# EAGLE schematic MIXER (EAGLE 9.2.2)

## Sheet 1 of 6: Main Board Top Level
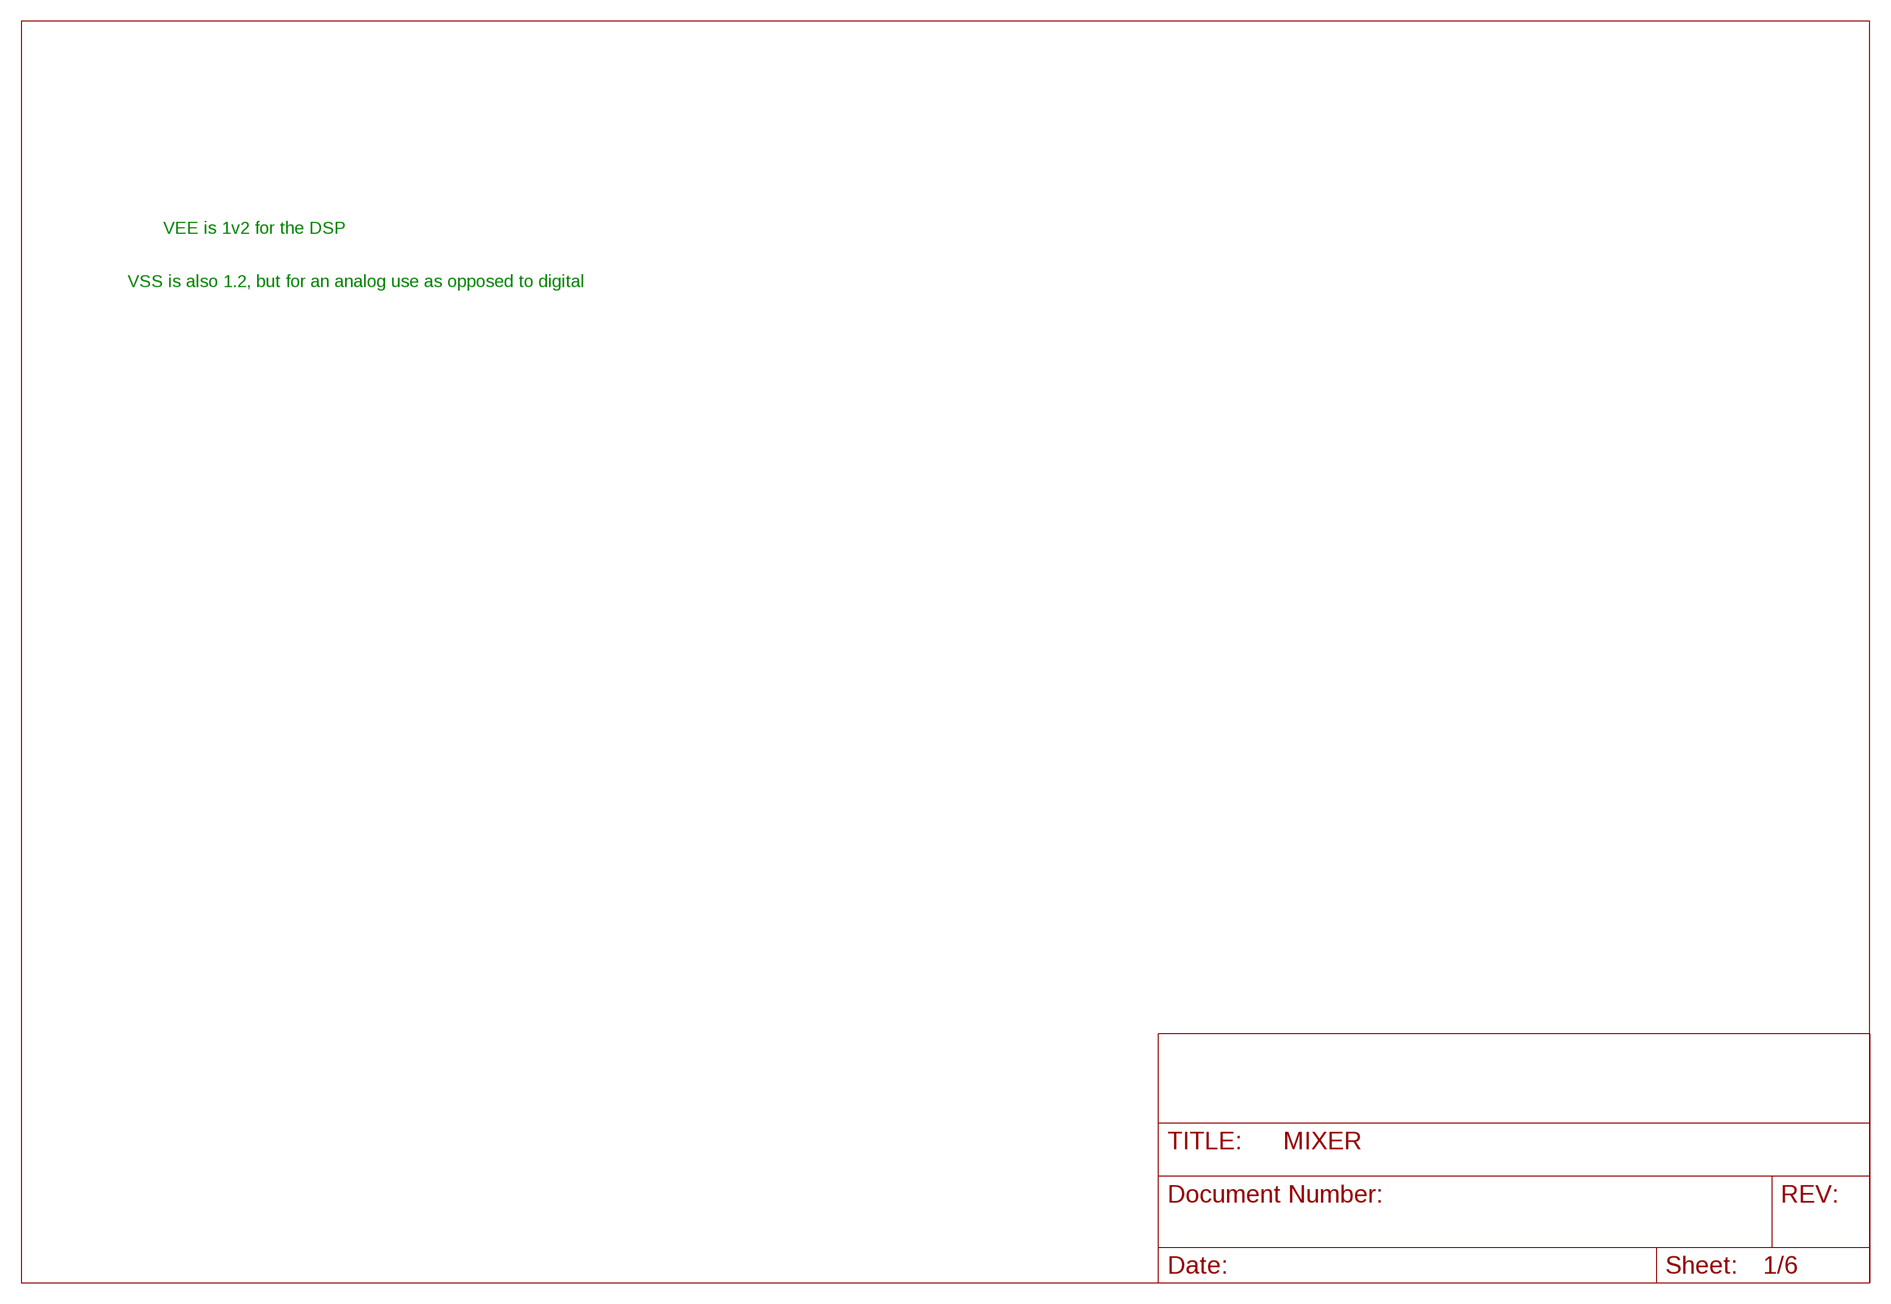
[diagram p0: schematic, sheet 1]

### Notes on the sheet
- VEE is 1v2 for the DSP
- VSS is also 1.2, but for an analog use as opposed to digital

## Sheet 2 of 6: Power Supply
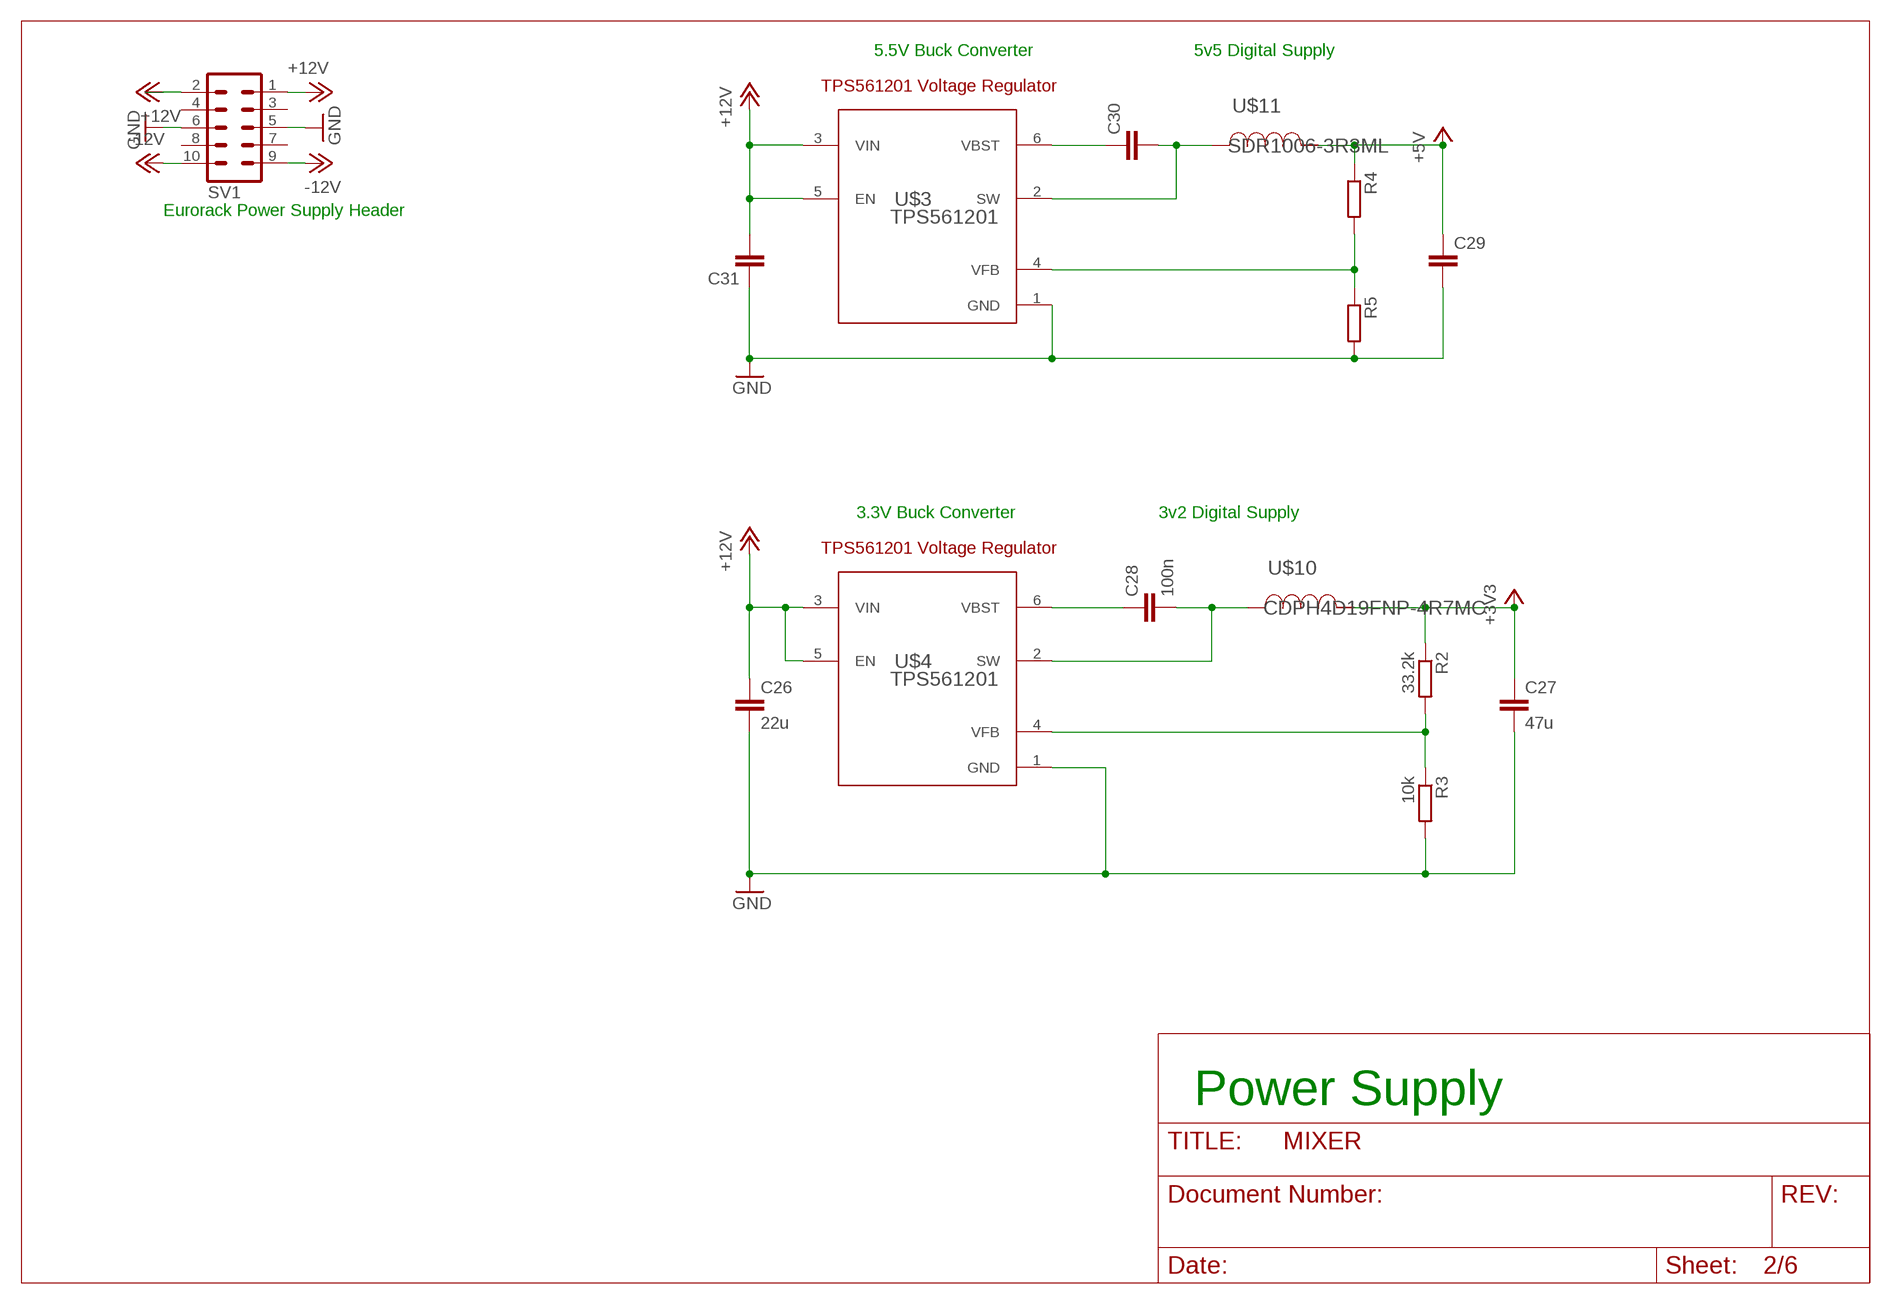
[diagram p1: schematic, sheet 2]

### Parts
C26  22u  C-EUC0805  [C0805]
C27  47u  C-EUC0805  [C0805]
C28  100n  C-EUC0805  [C0805]
C29  C-EUC0805  [C0805]
C30  C-EUC0805  [C0805]
C31  C-EUC0805  [C0805]
R2  33.2k  R-EU_R0805  [R0805]
R3  10k  R-EU_R0805  [R0805]
R4  R-EU_R0805  [R0805]
R5  R-EU_R0805  [R0805]
SV1  MA05-2  [MA05-2]
U$3  TPS561201  [DDC0006A]
U$4  TPS561201  [DDC0006A]
U$10  CDPH4D19FNP-4R7MC  [CDPH4D19F]
U$11  SDR1006-3R3ML  [SDR1006]

### Nets
+3V3: C27.1 R2.1 U$10.2 ; also sheet 3,4
+5V: C29.1 R4.1 U$11.2
+12V: C26.1 C31.2 SV1.1 SV1.2 U$3.3(VIN) U$3.5(EN) U$4.3(VIN) U$4.5(EN)
-12V: SV1.9 SV1.10
GND: C26.2 C27.2 C29.2 C31.1 R3.2 R5.2 SV1.5 SV1.6 U$3.1(GND) U$4.1(GND) ; also sheet 3,4
N$2: C30.1 U$3.6(VBST)
N$3: C28.1 U$4.6(VBST)
N$4: C28.2 U$4.2(SW) U$10.1
N$5: C30.2 U$3.2(SW) U$11.1
N$6: R2.2 R3.1 U$4.4(VFB)
N$8: R4.2 R5.1 U$3.4(VFB)
Unconnected: SV1.3 SV1.4 SV1.7 SV1.8

### Notes on the sheet
- 5.5V Buck Converter | 5v5 Digital Supply
- Eurorack Power Supply Header
- 3.3V Buck Converter | 3v2 Digital Supply
- Power Supply

## Sheet 3 of 6: Supply Decoupling
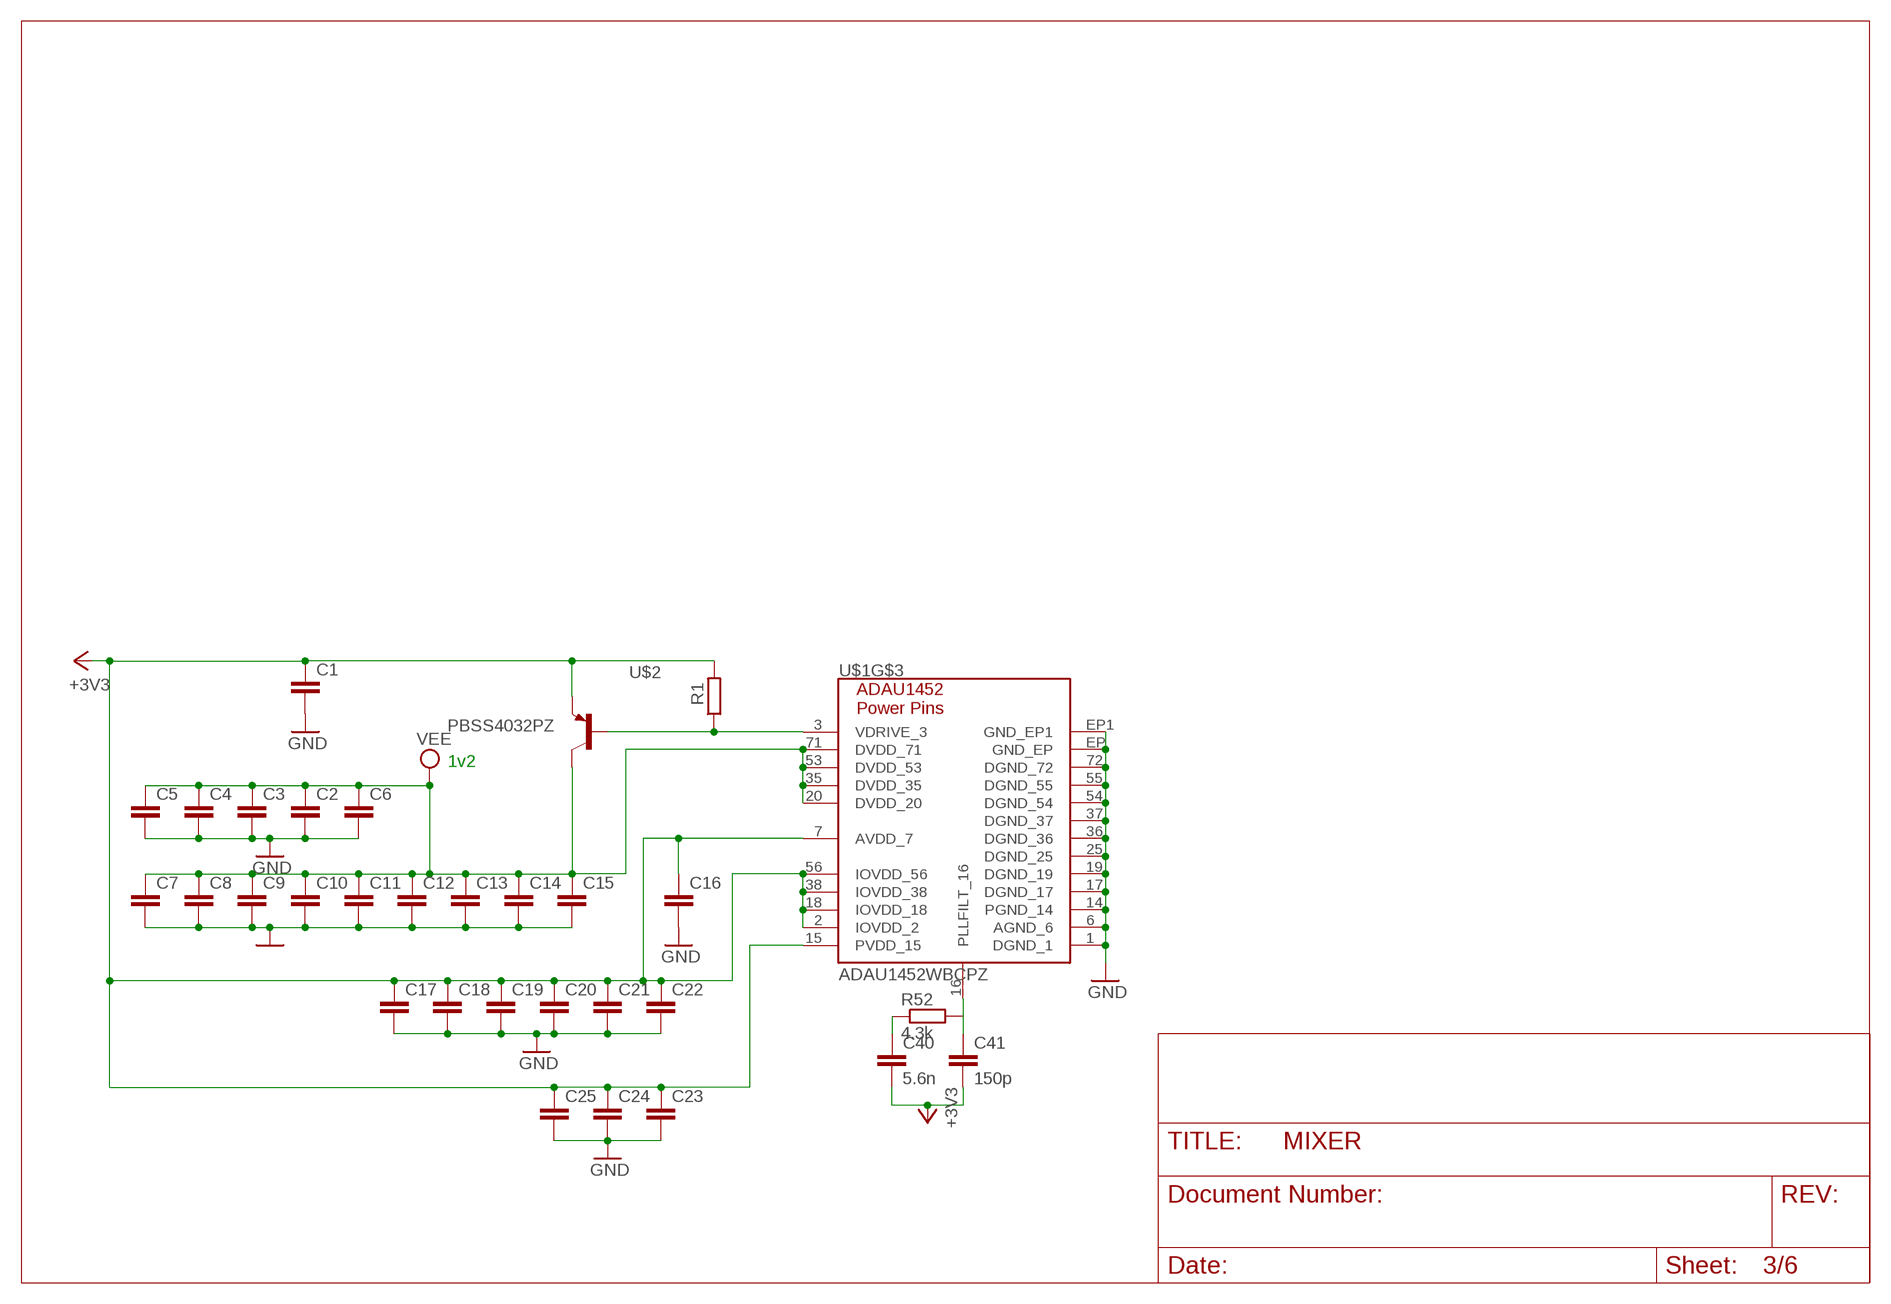
[diagram p2: schematic, sheet 3]

### Parts
C1  C-EUC0603  [C0603]
C2  C-EUC0603  [C0603]
C3  C-EUC0603  [C0603]
C4  C-EUC0603  [C0603]
C5  C-EUC0603  [C0603]
C6  C-EUC0603  [C0603]
C7  C-EUC0603  [C0603]
C8  C-EUC0603  [C0603]
C9  C-EUC0603  [C0603]
C10  C-EUC0603  [C0603]
C11  C-EUC0603  [C0603]
C12  C-EUC0603  [C0603]
C13  C-EUC0603  [C0603]
C14  C-EUC0603  [C0603]
C15  C-EUC0603  [C0603]
C16  C-EUC0603  [C0603]
C17  C-EUC0603  [C0603]
C18  C-EUC0603  [C0603]
C19  C-EUC0603  [C0603]
C20  C-EUC0603  [C0603]
C21  C-EUC0603  [C0603]
C22  C-EUC0603  [C0603]
C23  C-EUC0603  [C0603]
C24  C-EUC0603  [C0603]
C25  C-EUC0603  [C0603]
C40  5.6n  C-EUC0805  [C0805]
C41  150p  C-EUC0805  [C0805]
R1  R-EU_R0603  [R0603]
R52  4.3k  R-EU_R0603  [R0603]
U$1  ADAU1452WBCPZ  [72-LEADLFCSP_VQ]
U$2  PBSS4032PZ  [PG-SOT-223]

### Nets
+3V3: C1.1 C16.1 C17.1 C18.1 C19.1 C20.1 C21.1 C22.1 C23.1 C24.1 C25.1 C40.2 C41.2 R1.2 U$1.2(IOVDD_2) U$1.7(AVDD_7) U$1.15(PVDD_15) U$1.18(IOVDD_18) U$1.38(IOVDD_38) U$1.56(IOVDD_56) U$2.3(EMITTER_3) ; also sheet 2,4
GND: C1.2 C2.2 C3.2 C4.2 C5.2 C6.2 C7.2 C8.2 C9.2 C10.2 C11.2 C12.2 C13.2 C14.2 C15.2 C16.2 C17.2 C18.2 C19.2 C20.2 C21.2 C22.2 C23.2 C24.2 C25.2 U$1.1(DGND_1) U$1.6(AGND_6) U$1.14(PGND_14) U$1.17(DGND_17) U$1.19(DGND_19) U$1.25(DGND_25) U$1.36(DGND_36) U$1.37(DGND_37) U$1.54(DGND_54) U$1.55(DGND_55) U$1.72(DGND_72) U$1.EP1(GND_EP1) U$1.EP(GND_EP) ; also sheet 2,4
N$1: R1.1 U$1.3(VDRIVE_3) U$2.1(BASE_1)
N$21: C41.1 U$1.16(PLLFILT_16)
N$24: C40.1 R52.1
VEE: C2.1 C3.1 C4.1 C5.1 C6.1 C7.1 C8.1 C9.1 C10.1 C11.1 C12.1 C13.1 C14.1 C15.1 U$1.20(DVDD_20) U$1.35(DVDD_35) U$1.53(DVDD_53) U$1.71(DVDD_71) U$2.2(COLLECTOR_2,4) U$2.4(COLLECTOR_2,4)
Unconnected: R52.2

### Notes on the sheet
- 1v2

## Sheet 4 of 6: Controller, I2C & GPIO
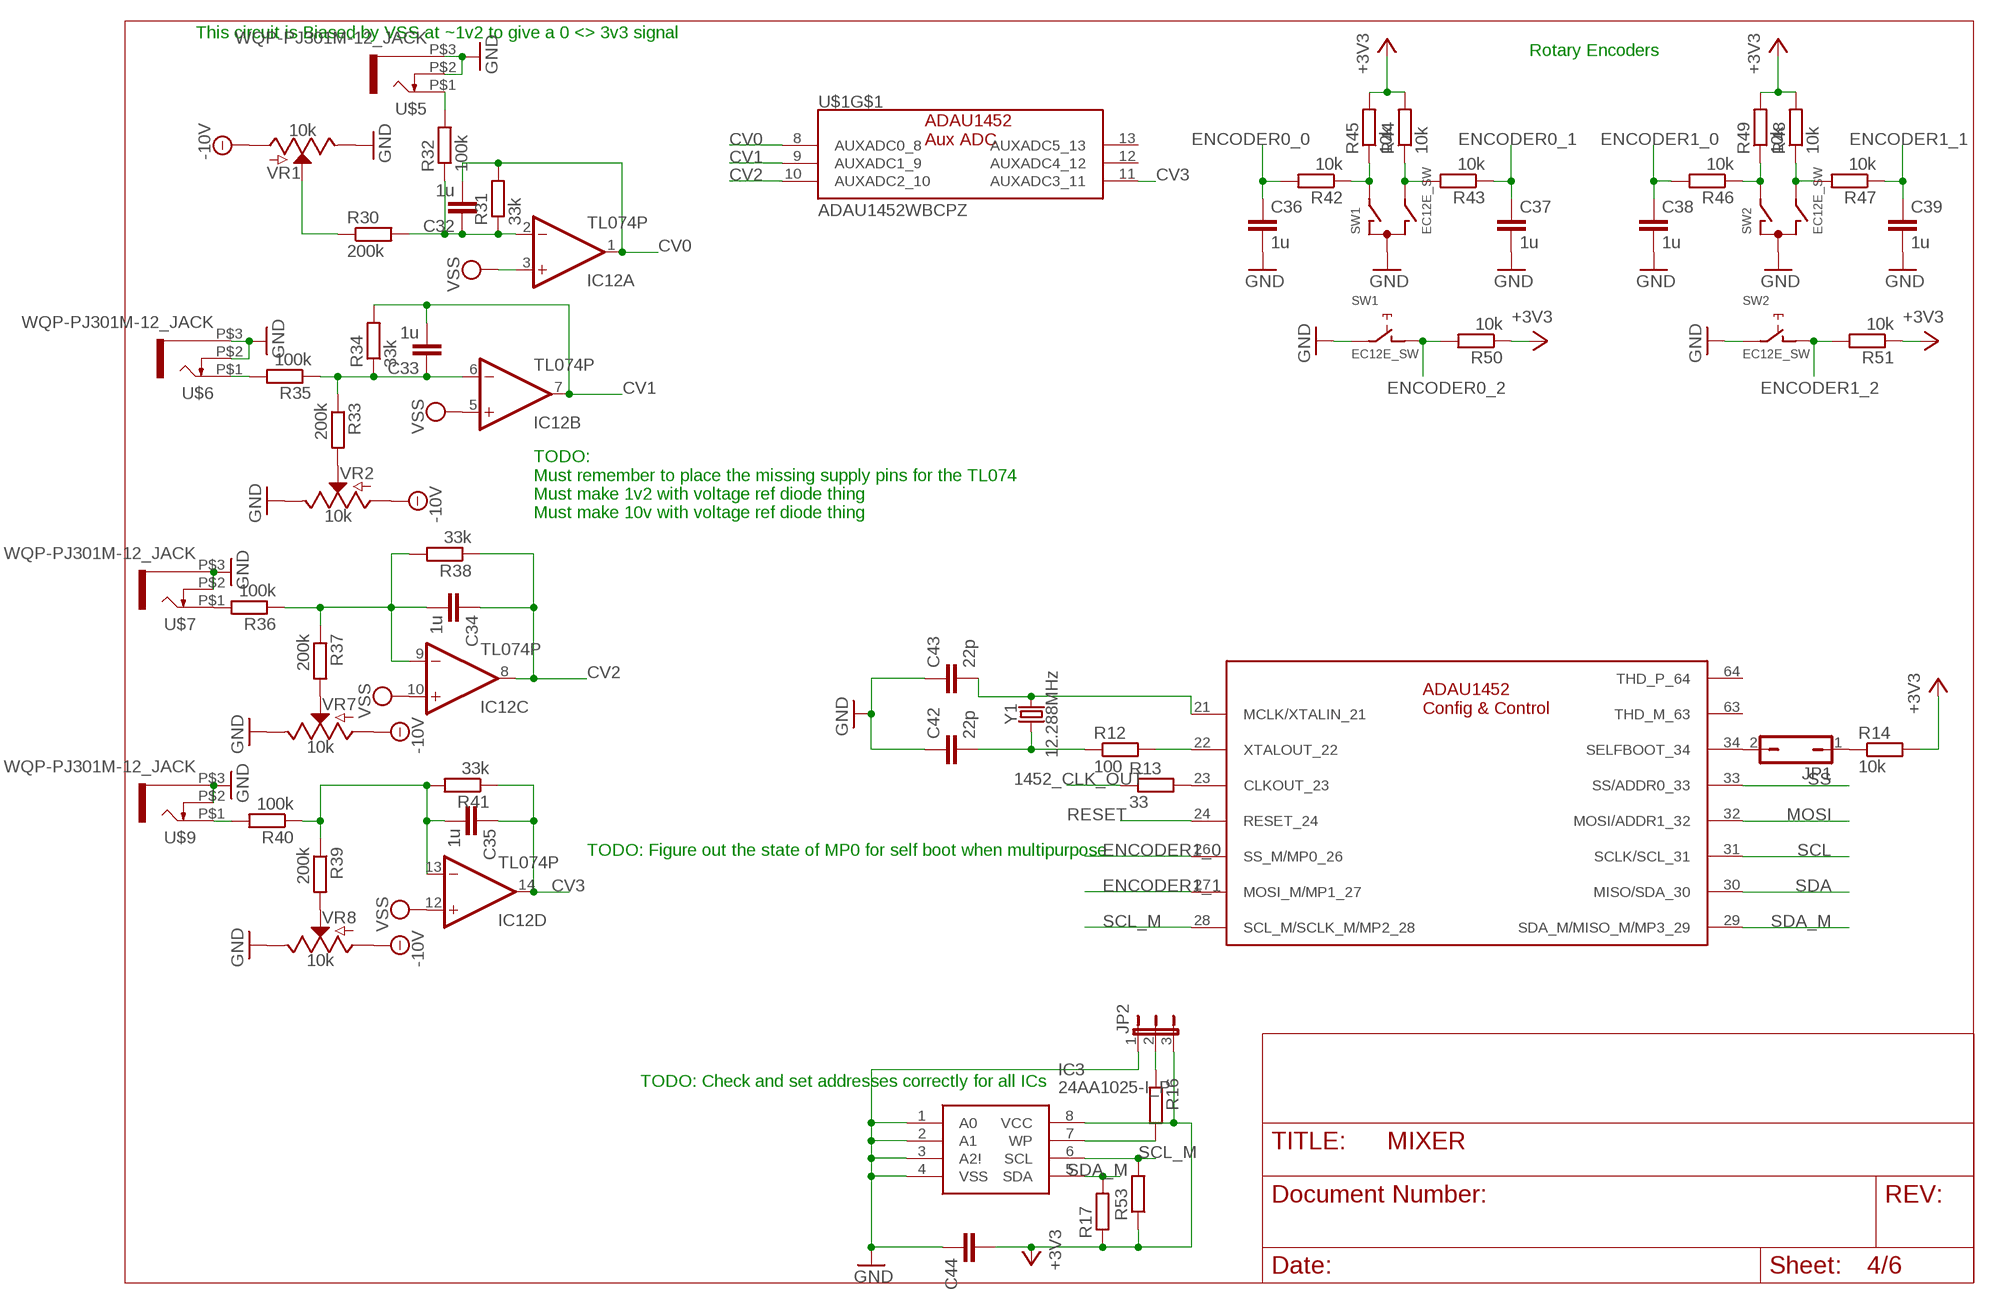
[diagram p3: schematic, sheet 4]

### Parts
C32  1u  C-EUC0805  [C0805]
C33  1u  C-EUC0805  [C0805]
C34  1u  C-EUC0805  [C0805]
C35  1u  C-EUC0805  [C0805]
C36  1u  C-EUC0805  [C0805]
C37  1u  C-EUC0805  [C0805]
C38  1u  C-EUC0805  [C0805]
C39  1u  C-EUC0805  [C0805]
C42  22p  C-EUC0805  [C0805]
C43  22p  C-EUC0805  [C0805]
C44  C-EUC0805  [C0805]
IC3  24AA1025-I_P  [DIP781W56P254L950H533Q8N]
IC12  TL074P  [DIL14]
JP1  JP1Q  [JP1]
JP2  JP2W  [JP2W]
R12  100  R-EU_R0603  [R0603]
R13  33  R-EU_R0603  [R0603]
R14  10k  R-EU_R0603  [R0603]
R16  R-EU_R0603  [R0603]
R17  R-EU_R0603  [R0603]
R30  200k  R-EU_R0603  [R0603]
R31  33k  R-EU_R0603  [R0603]
R32  100k  R-EU_R0603  [R0603]
R33  200k  R-EU_R0603  [R0603]
R34  33k  R-EU_R0603  [R0603]
R35  100k  R-EU_R0603  [R0603]
R36  100k  R-EU_R0603  [R0603]
R37  200k  R-EU_R0603  [R0603]
R38  33k  R-EU_R0603  [R0603]
R39  200k  R-EU_R0603  [R0603]
R40  100k  R-EU_R0603  [R0603]
R41  33k  R-EU_R0603  [R0603]
R42  10k  R-EU_R0603  [R0603]
R43  10k  R-EU_R0603  [R0603]
R44  10k  R-EU_R0603  [R0603]
R45  10k  R-EU_R0603  [R0603]
R46  10k  R-EU_R0603  [R0603]
R47  10k  R-EU_R0603  [R0603]
R48  10k  R-EU_R0603  [R0603]
R49  10k  R-EU_R0603  [R0603]
R50  10k  R-EU_R0603  [R0603]
R51  10k  R-EU_R0603  [R0603]
R53  R-EU_R0603  [R0603]
SW1  EC12E_SW  [ALPS_EC12E_SW]
SW2  EC12E_SW  [ALPS_EC12E_SW]
U$5  WQP-PJ301M-12_JACK  [WQP-PJ301M-12_JACK]
U$6  WQP-PJ301M-12_JACK  [WQP-PJ301M-12_JACK]
U$7  WQP-PJ301M-12_JACK  [WQP-PJ301M-12_JACK]
U$9  WQP-PJ301M-12_JACK  [WQP-PJ301M-12_JACK]
VR1  10k  POTENTIOMETER-PTH-9MM-1/20W-20%-KIT  [POT-PTH-ALPS-KIT]
VR2  10k  POTENTIOMETER-PTH-9MM-1/20W-20%-KIT  [POT-PTH-ALPS-KIT]
VR7  10k  POTENTIOMETER-PTH-9MM-1/20W-20%-KIT  [POT-PTH-ALPS-KIT]
VR8  10k  POTENTIOMETER-PTH-9MM-1/20W-20%-KIT  [POT-PTH-ALPS-KIT]
Y1  12.288MHz  CRYSTAL-12.288MHZ"  [CRYSTAL-SMD-5X3.2-4PAD]

### Nets
1452_CLK_OUT: R13.1
+3V3: C44.2 IC3.8(VCC) JP2.3 R14.2 R17.1 R44.2 R45.2 R48.2 R49.2 R50.1 R51.1 R53.1 ; also sheet 2,3
-10V: VR1.P$3(A) VR2.P$3(A) VR7.P$3(A) VR8.P$3(A)
CV0: C32.2 IC12.1(A:OUT) R31.2 U$1.8(AUXADC0_8)
CV1: C33.2 IC12.7(B:OUT) R34.2 U$1.9(AUXADC1_9)
CV2: C34.1 IC12.8(C:OUT) R38.1 U$1.10(AUXADC2_10)
CV3: C35.1 IC12.14(D:OUT) R41.1 U$1.11(AUXADC3_11)
ENCODER0_0: C36.1 R42.2 ; also sheet 5
ENCODER0_1: C37.1 R43.1 ; also sheet 5
ENCODER0_2: R50.2 SW1.D ; also sheet 5
ENCODER1_0: C38.1 R46.2 U$1.26(SS_M/MP0_26)
ENCODER1_1: C39.1 R47.1 U$1.27(MOSI_M/MP1_27)
ENCODER1_2: R51.2 SW2.D ; also sheet 5
GND: C36.2 C37.2 C38.2 C39.2 C42.1 C43.1 C44.1 IC3.1(A0) IC3.2(A1) IC3.3(A2!) IC3.4(VSS) JP2.1 SW1.C SW1.E SW2.C SW2.E U$5.P$2 U$5.P$3 U$6.P$2 U$6.P$3 U$7.P$2 U$7.P$3 U$9.P$2 U$9.P$3 VR1.P$1(E) VR2.P$1(E) VR7.P$1(E) VR8.P$1(E) ; also sheet 2,3
MOSI: U$1.32(MOSI/ADDR1_32)
N$7: JP2.2 R16.1
N$9: R32.2 U$5.P$1
N$10: C32.1 IC12.2(A:-IN) R30.2 R31.1 R32.1
N$11: R36.2 U$7.P$1
N$12: R30.1 VR1.P$2(S)
N$13: R35.2 U$6.P$1
N$14: R33.2 VR2.P$2(S)
N$15: C33.1 IC12.6(B:-IN) R33.1 R34.1 R35.1
N$16: R37.2 VR7.P$2(S)
N$17: C34.2 IC12.9(C:-IN) R36.1 R37.1 R38.2
N$18: R39.2 VR8.P$2(S)
N$19: R40.2 U$9.P$1
N$20: C35.2 IC12.13(D:-IN) R39.1 R40.1 R41.2
N$22: R42.1 R45.1 SW1.A
N$23: R43.2 R44.1 SW1.B
N$25: R46.1 R49.1 SW2.A
N$26: R47.2 R48.1 SW2.B
N$27: R12.2 U$1.22(XTALOUT_22)
N$28: C42.2 R12.1 Y1.1
N$29: C43.2 U$1.21(MCLK/XTALIN_21) Y1.3
N$30: R13.2 U$1.23(CLKOUT_23)
N$31: JP1.2 U$1.34(SELFBOOT_34)
N$32: JP1.1 R14.1
N$33: IC3.7(WP) R16.2
RESET: U$1.24(RESET_24)
SCL: U$1.31(SCLK/SCL_31)
SCL_M: IC3.6(SCL) R53.2 U$1.28(SCL_M/SCLK_M/MP2_28)
SDA: U$1.30(MISO/SDA_30)
SDA_M: IC3.5(SDA) R17.2 U$1.29(SDA_M/MISO_M/MP3_29)
SS: U$1.33(SS/ADDR0_33)
VSS: IC12.3(A:+IN) IC12.5(B:+IN) IC12.10(C:+IN) IC12.12(D:+IN)
Unconnected: SW1.GND1(G) SW1.GND2(G) SW2.GND1(G) SW2.GND2(G) U$1.12(AUXADC4_12) U$1.13(AUXADC5_13) U$1.63(THD_M_63) U$1.64(THD_P_64)

### Notes on the sheet
- This circuit is Biased by VSS at ~1v2 to give a 0 <> 3v3 signal
- Rotary Encoders
- TODO:
  Must remember to place the missing supply pins for the TL074
  Must make 1v2 with voltage ref diode thing
  Must make 10v with voltage ref diode thing
- TODO: Figure out the state of MP0 for self boot when multipurpose
- TODO: Check and set addresses correctly for all ICs

## Sheet 5 of 6: Audio In
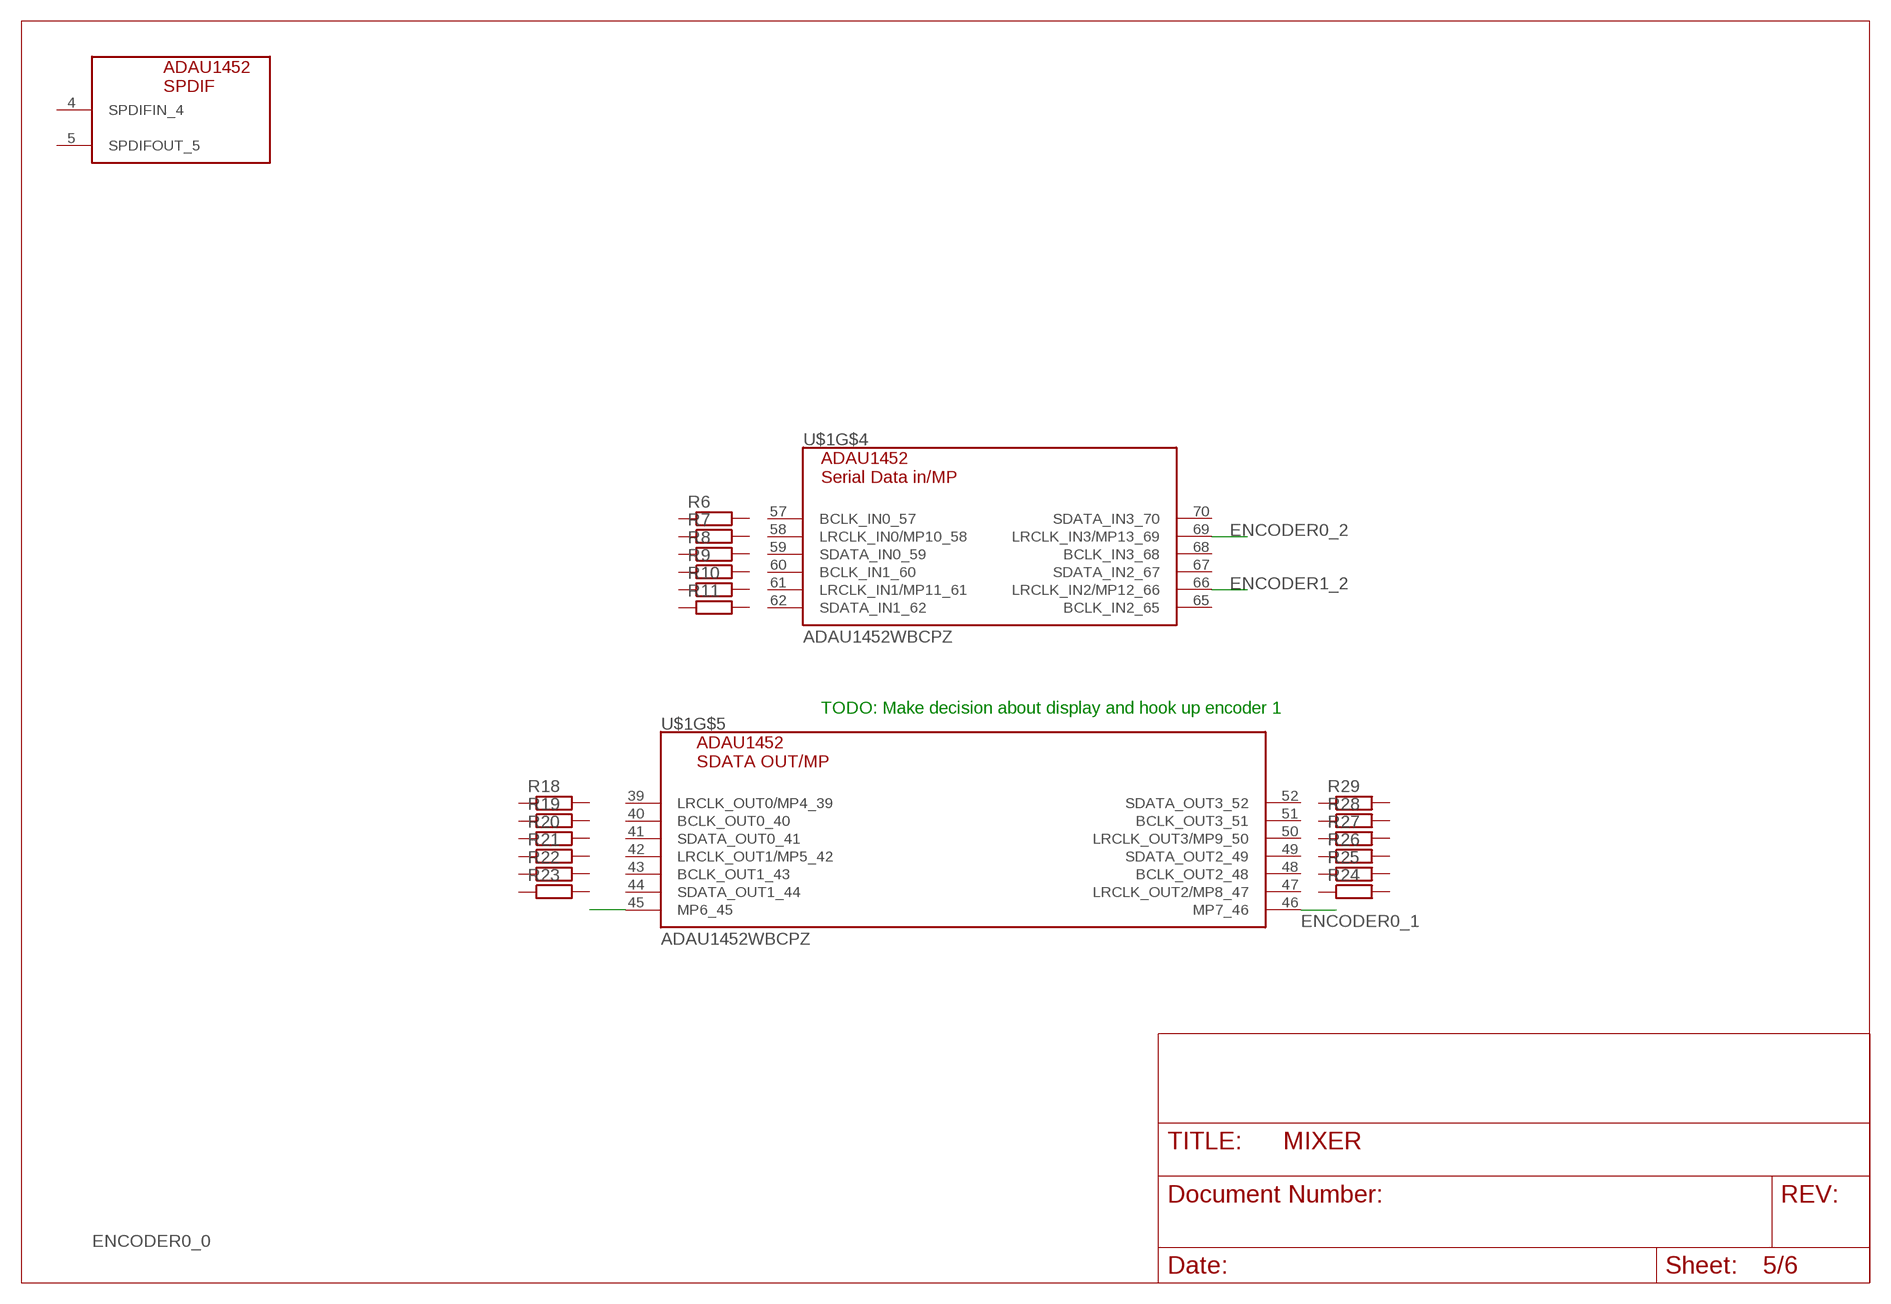
[diagram p4: schematic, sheet 5]

### Parts
R6  R-EU_R0603  [R0603]
R7  R-EU_R0603  [R0603]
R8  R-EU_R0603  [R0603]
R9  R-EU_R0603  [R0603]
R10  R-EU_R0603  [R0603]
R11  R-EU_R0603  [R0603]
R18  R-EU_R0603  [R0603]
R19  R-EU_R0603  [R0603]
R20  R-EU_R0603  [R0603]
R21  R-EU_R0603  [R0603]
R22  R-EU_R0603  [R0603]
R23  R-EU_R0603  [R0603]
R24  R-EU_R0603  [R0603]
R25  R-EU_R0603  [R0603]
R26  R-EU_R0603  [R0603]
R27  R-EU_R0603  [R0603]
R28  R-EU_R0603  [R0603]
R29  R-EU_R0603  [R0603]

### Nets
ENCODER0_0: U$1.45(MP6_45) ; also sheet 4
ENCODER0_1: U$1.46(MP7_46) ; also sheet 4
ENCODER0_2: U$1.69(LRCLK_IN3/MP13_69) ; also sheet 4
ENCODER1_2: U$1.66(LRCLK_IN2/MP12_66) ; also sheet 4
Unconnected: R6.1 R6.2 R7.1 R7.2 R8.1 R8.2 R9.1 R9.2 R10.1 R10.2 R11.1 R11.2 R18.1 R18.2 R19.1 R19.2 R20.1 R20.2 R21.1 R21.2 R22.1 R22.2 R23.1 R23.2 R24.1 R24.2 R25.1 R25.2 R26.1 R26.2 R27.1 R27.2 R28.1 R28.2 R29.1 R29.2 U$1.4(SPDIFIN_4) U$1.5(SPDIFOUT_5) U$1.39(LRCLK_OUT0/MP4_39) U$1.40(BCLK_OUT0_40) U$1.41(SDATA_OUT0_41) U$1.42(LRCLK_OUT1/MP5_42) U$1.43(BCLK_OUT1_43) U$1.44(SDATA_OUT1_44) U$1.47(LRCLK_OUT2/MP8_47) U$1.48(BCLK_OUT2_48) U$1.49(SDATA_OUT2_49) U$1.50(LRCLK_OUT3/MP9_50) U$1.51(BCLK_OUT3_51) U$1.52(SDATA_OUT3_52) U$1.57(BCLK_IN0_57) U$1.58(LRCLK_IN0/MP10_58) U$1.59(SDATA_IN0_59) U$1.60(BCLK_IN1_60) U$1.61(LRCLK_IN1/MP11_61) U$1.62(SDATA_IN1_62) U$1.65(BCLK_IN2_65) U$1.67(SDATA_IN2_67) U$1.68(BCLK_IN3_68) U$1.70(SDATA_IN3_70)

### Notes on the sheet
- TODO: Make decision about display and hook up encoder 1

## Sheet 6 of 6: Analog Audio
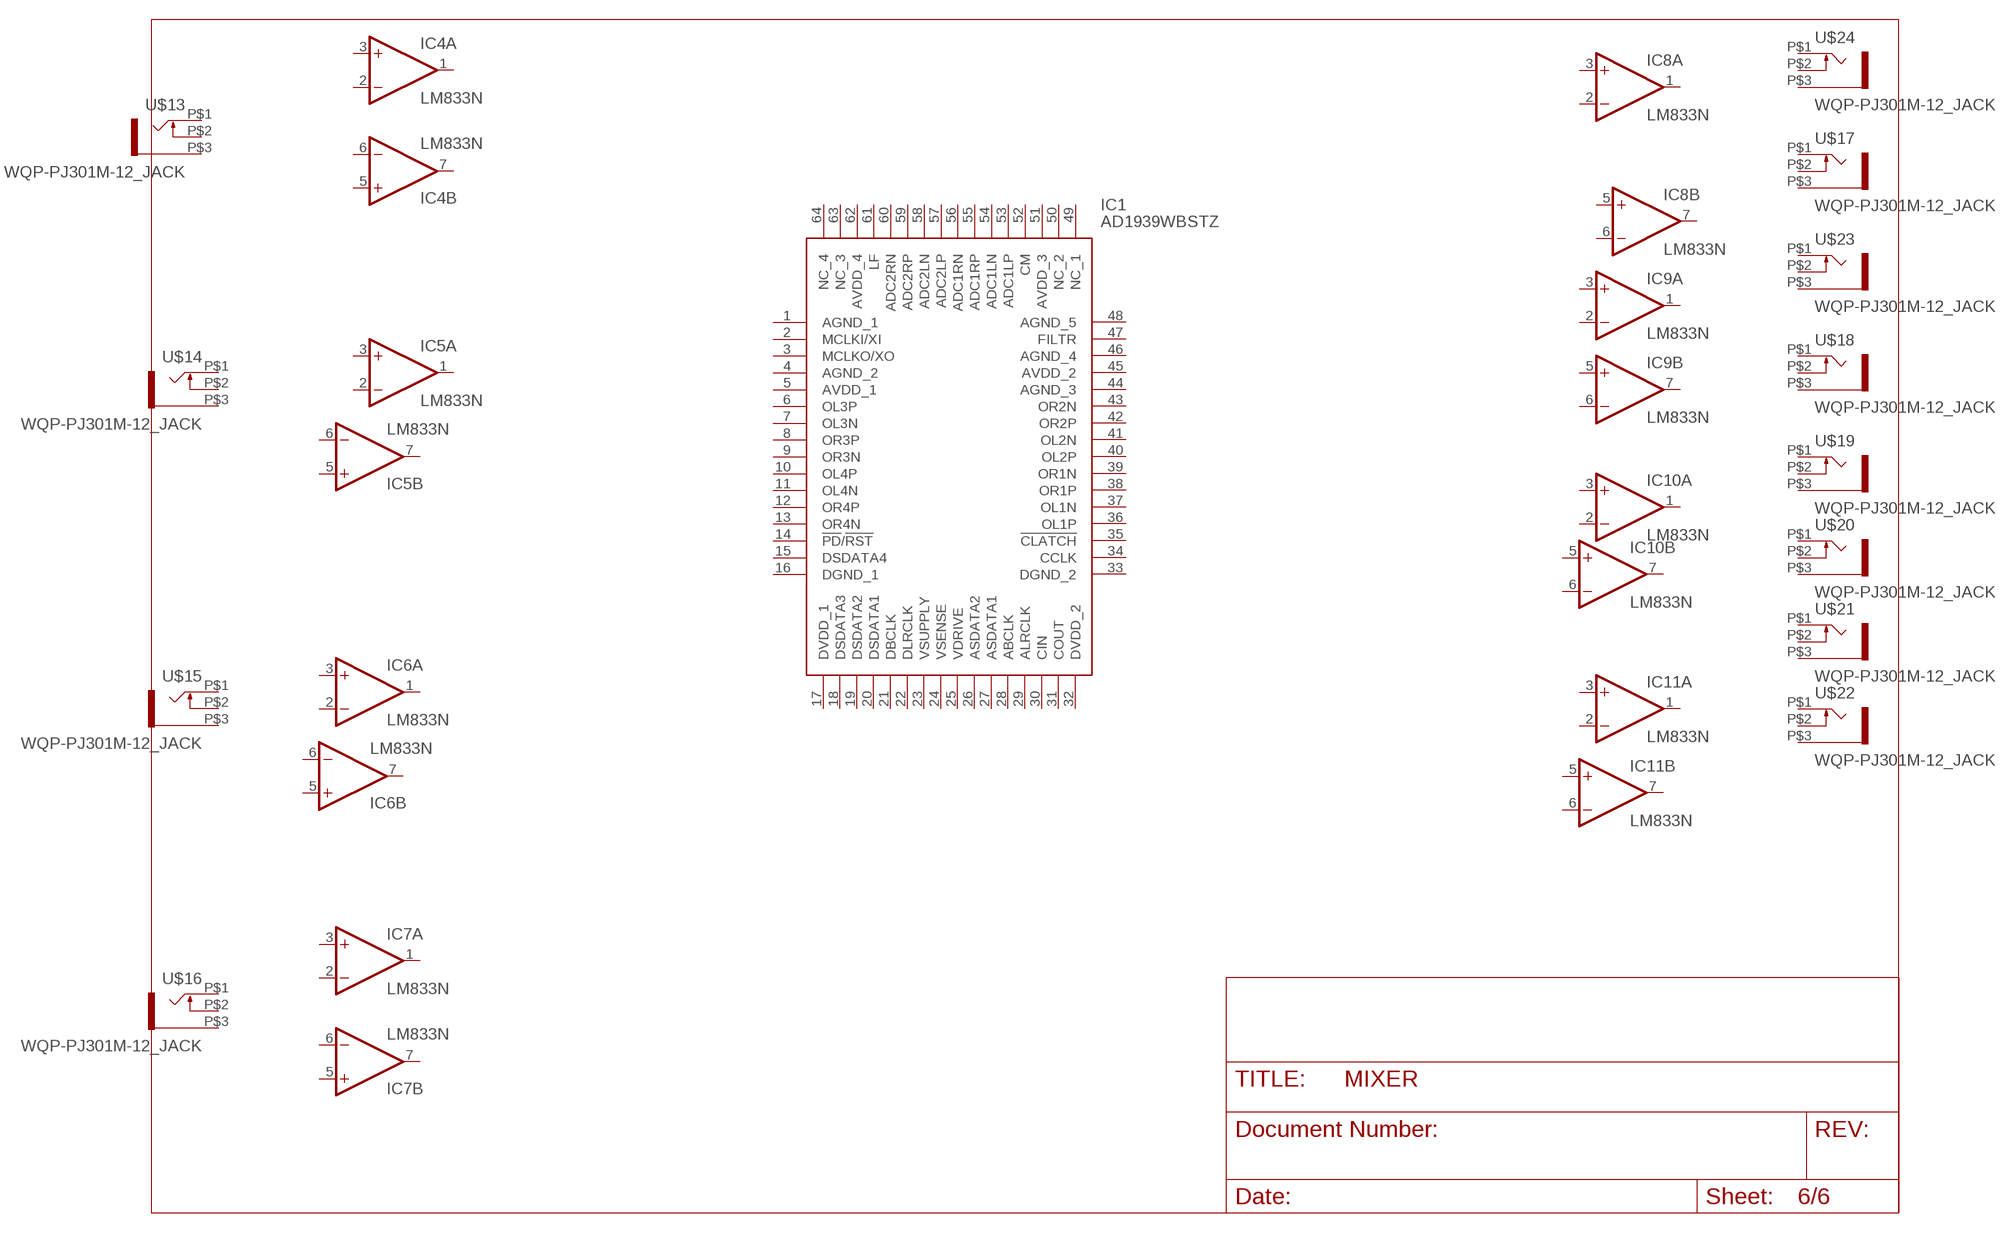
[diagram p5: schematic, sheet 6]

### Parts
IC1  AD1939WBSTZ  [QFP50P1200X1200X160-64N]
IC4  LM833N  [DIL08]
IC5  LM833N  [DIL08]
IC6  LM833N  [DIL08]
IC7  LM833N  [DIL08]
IC8  LM833N  [DIL08]
IC9  LM833N  [DIL08]
IC10  LM833N  [DIL08]
IC11  LM833N  [DIL08]
U$13  WQP-PJ301M-12_JACK  [WQP-PJ301M-12_JACK]
U$14  WQP-PJ301M-12_JACK  [WQP-PJ301M-12_JACK]
U$15  WQP-PJ301M-12_JACK  [WQP-PJ301M-12_JACK]
U$16  WQP-PJ301M-12_JACK  [WQP-PJ301M-12_JACK]
U$17  WQP-PJ301M-12_JACK  [WQP-PJ301M-12_JACK]
U$18  WQP-PJ301M-12_JACK  [WQP-PJ301M-12_JACK]
U$19  WQP-PJ301M-12_JACK  [WQP-PJ301M-12_JACK]
U$20  WQP-PJ301M-12_JACK  [WQP-PJ301M-12_JACK]
U$21  WQP-PJ301M-12_JACK  [WQP-PJ301M-12_JACK]
U$22  WQP-PJ301M-12_JACK  [WQP-PJ301M-12_JACK]
U$23  WQP-PJ301M-12_JACK  [WQP-PJ301M-12_JACK]
U$24  WQP-PJ301M-12_JACK  [WQP-PJ301M-12_JACK]
Unconnected: IC1.1(AGND_1) IC1.2(MCLKI/XI) IC1.3(MCLKO/XO) IC1.4(AGND_2) IC1.5(AVDD_1) IC1.6(OL3P) IC1.7(OL3N) IC1.8(OR3P) IC1.9(OR3N) IC1.10(OL4P) IC1.11(OL4N) IC1.12(OR4P) IC1.13(OR4N) IC1.14(!PD!/!RST) IC1.15(DSDATA4) IC1.16(DGND_1) IC1.17(DVDD_1) IC1.18(DSDATA3) IC1.19(DSDATA2) IC1.20(DSDATA1) IC1.21(DBCLK) IC1.22(DLRCLK) IC1.23(VSUPPLY) IC1.24(VSENSE) IC1.25(VDRIVE) IC1.26(ASDATA2) IC1.27(ASDATA1) IC1.28(ABCLK) IC1.29(ALRCLK) IC1.30(CIN) IC1.31(COUT) IC1.32(DVDD_2) IC1.33(DGND_2) IC1.34(CCLK) IC1.35(!CLATCH) IC1.36(OL1P) IC1.37(OL1N) IC1.38(OR1P) IC1.39(OR1N) IC1.40(OL2P) IC1.41(OL2N) IC1.42(OR2P) IC1.43(OR2N) IC1.44(AGND_3) IC1.45(AVDD_2) IC1.46(AGND_4) IC1.47(FILTR) IC1.48(AGND_5) IC1.49(NC_1) IC1.50(NC_2) IC1.51(AVDD_3) IC1.52(CM) IC1.53(ADC1LP) IC1.54(ADC1LN) IC1.55(ADC1RP) IC1.56(ADC1RN) IC1.57(ADC2LP) IC1.58(ADC2LN) IC1.59(ADC2RP) IC1.60(ADC2RN) IC1.61(LF) IC1.62(AVDD_4) IC1.63(NC_3) IC1.64(NC_4) IC4.1(A:OUT) IC4.2(A:-IN) IC4.3(A:+IN) IC4.5(B:+IN) IC4.6(B:-IN) IC4.7(B:OUT) IC5.1(A:OUT) IC5.2(A:-IN) IC5.3(A:+IN) IC5.5(B:+IN) IC5.6(B:-IN) IC5.7(B:OUT) IC6.1(A:OUT) IC6.2(A:-IN) IC6.3(A:+IN) IC6.5(B:+IN) IC6.6(B:-IN) IC6.7(B:OUT) IC7.1(A:OUT) IC7.2(A:-IN) IC7.3(A:+IN) IC7.5(B:+IN) IC7.6(B:-IN) IC7.7(B:OUT) IC8.1(A:OUT) IC8.2(A:-IN) IC8.3(A:+IN) IC8.5(B:+IN) IC8.6(B:-IN) IC8.7(B:OUT) IC9.1(A:OUT) IC9.2(A:-IN) IC9.3(A:+IN) IC9.5(B:+IN) IC9.6(B:-IN) IC9.7(B:OUT) IC10.1(A:OUT) IC10.2(A:-IN) IC10.3(A:+IN) IC10.5(B:+IN) IC10.6(B:-IN) IC10.7(B:OUT) IC11.1(A:OUT) IC11.2(A:-IN) IC11.3(A:+IN) IC11.5(B:+IN) IC11.6(B:-IN) IC11.7(B:OUT) U$13.P$1 U$13.P$2 U$13.P$3 U$14.P$1 U$14.P$2 U$14.P$3 U$15.P$1 U$15.P$2 U$15.P$3 U$16.P$1 U$16.P$2 U$16.P$3 U$17.P$1 U$17.P$2 U$17.P$3 U$18.P$1 U$18.P$2 U$18.P$3 U$19.P$1 U$19.P$2 U$19.P$3 U$20.P$1 U$20.P$2 U$20.P$3 U$21.P$1 U$21.P$2 U$21.P$3 U$22.P$1 U$22.P$2 U$22.P$3 U$23.P$1 U$23.P$2 U$23.P$3 U$24.P$1 U$24.P$2 U$24.P$3

## Power pins joined to a net without a drawn wire
V+: IC4.8(P:V+) IC5.8(P:V+) IC6.8(P:V+) IC7.8(P:V+) IC8.8(P:V+) IC9.8(P:V+) IC10.8(P:V+) IC11.8(P:V+) IC12.4(P:V+)
V-: IC4.4(P:V-) IC5.4(P:V-) IC6.4(P:V-) IC7.4(P:V-) IC8.4(P:V-) IC9.4(P:V-) IC10.4(P:V-) IC11.4(P:V-) IC12.11(P:V-)

## Library data of the parts
C1-C44 = rcl:C-EU: CAPACITOR, European symbol; SPICEPREFIX: C
IC1 = AD1939WBSTZ:AD1939WBSTZ: Audio Codec 4ADC / 8DAC 24-Bit LQFP64 Analog Devices, Audio Codec Stereo Audio 12-channel 24bit- 192kHz Serial 64-Pin LQFP Source: Datasheet <https://componentsearchengine.com/Datasheets/1/AD1939WBSTZ.pdf>; DESCRIPTION: Audio Codec 4ADC / 8DAC 24-Bit LQFP64 Analog Devices, Audio Codec Stereo Audio 12-channel 24bit- 192kHz Serial 64-Pin LQFP; HEIGHT: 1.6mm; MANUFACTURER_NAME: Analog Devices; MANUFACTURER_PART_NUMBER: AD1939WBSTZ; MOUSER_PART_NUMBER: 584-AD1939WBSTZ
IC3 = SamacSys_Parts:24AA1025-I_P: Microchip 24AA1025-I/P Serial EEPROM Memory, 1Mbit, 900ns, 1.7 5.5 V 8-pin PDIP Source: Datasheet <https://componentsearchengine.com/Datasheets/1/24AA1025-I_P.pdf>; DESCRIPTION: Microchip 24AA1025-I/P Serial EEPROM Memory, 1Mbit, 900ns, 1.7 5.5 V 8-pin PDIP; HEIGHT: 5.334mm; MANUFACTURER_NAME: Microchip; MANUFACTURER_PART_NUMBER: 24AA1025-I/P; MOUSER_PART_NUMBER: 579-24AA1025-I/P
IC4-IC11 = linear:LM833: OP AMP
IC12 = linear:TL074: OP AMP
JP1 = jumper:JP1Q: JUMPER
JP2 = jumper:JP2W: JUMPER
R1-R14 R16-R53 = rcl:R-EU_: RESISTOR, European symbol; SPICEPREFIX: R
SV1 = con-lstb:MA05-2: PIN HEADER; OC_FARNELL: unknown; OC_NEWARK: unknown
SW1 SW2 = switch-alps:EC12E_SW: ALPS rotary Encoder EC12E series with switch; MPN: EC12E2424407; OC_FARNELL: 1520813; OC_NEWARK: 74M1068
U$1 = audioic:ADAU1452
U$2 = audioic:PBSS4032PZ
U$3 U$4 = texas3v3supplyLib:TPS561201
U$5-U$7 U$9 U$13-U$24 = thonkiconn:WQP-PJ301M-12_JACK
U$10 = texas3v3supplyLib:CDPH4D19FNP-4R7MC; DCR: 0.038; IDC: 1.15; L: 4.7E6; MANUFACTURER_NAME: Sumida; MANUFACTURER_PART_NUMBER: CDPH4D19FNP4R7MC; VENDOR: Sumida
U$11 = texas5v5supplyLib:SDR1006-3R3ML; DCR: 0.024; IDC: 5.0; L: 3.3E6; MANUFACTURER_NAME: Bourns; MANUFACTURER_PART_NUMBER: SDR10063R3ML; VENDOR: Bourns
VR1 VR2 VR7 VR8 = SparkFun-Resistors:POTENTIOMETER: Potentiometer (Pot) Three-terminal potentiometers, with an adjustable wiper and two adjustable resistors. A pot can be used to create a configurable voltage divider, or as a variable resistor. Variants ALPS_POT and ALPS_POT_KIT - PTH, breadboard compatible, 9mm square pots Rotary Potentiometer - Linear (10k ohm) <https://www.sparkfun.com/products/9288> (COM-09288) The KIT variant exposes copper on only one side of the PTH pad, so the part can only be assembled on one side of the PCB. Useful for beginner soldering kits.; PROD_ID: RES-09177; SF_SKU: COM-09288
Y1 = SparkFun-Clocks:CRYSTAL-12.288MHZ: 12.288MHz Crystal Digikey Example <http://www.digikey.com/product-detail/en/abracon-llc/ABM3B-12.288MHZ-B2-T/535-9117-1-ND/675634> Frequency: 12.288MHz Frequency Stability: ±50ppm Frequency Tolerance: ±20ppm Load Capacitance: 18pF SparkFun Products: MP3 Trigger <https://www.sparkfun.com/products/13720> SparkFun MP3 Player Shield <https://www.sparkfun.com/products/12660>; PROD_ID: XTAL-09653